# EAGLE design esp-rfid (EAGLE 9.6.2)
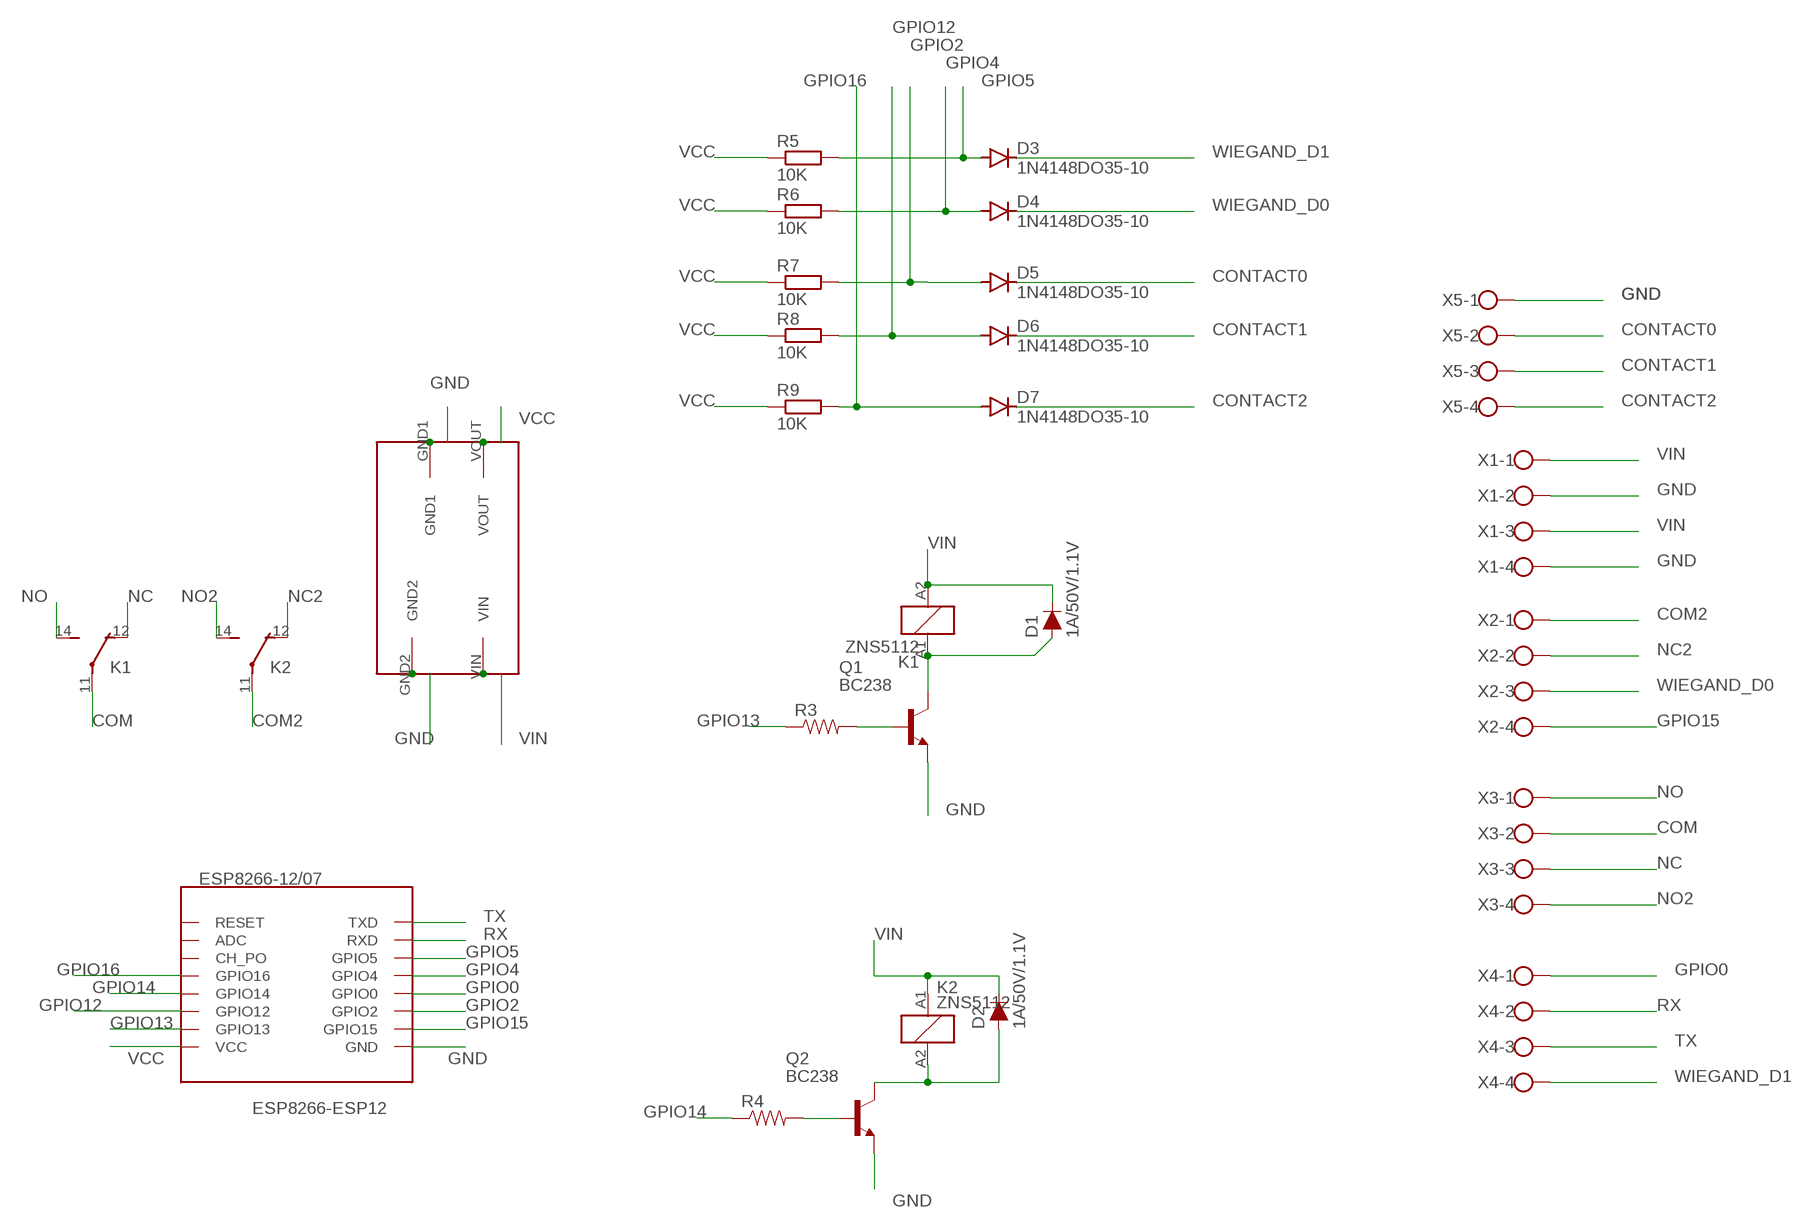
[diagram p0: schematic, sheet 1]

## Parts
D1  1A/50V/1.1V  DIODE-PTH  [DIODE-1N4001]
D2  1A/50V/1.1V  DIODE-PTH  [DIODE-1N4001]
D3  1N4148DO35-10  [DO35-10]
D4  1N4148DO35-10  [DO35-10]
D5  1N4148DO35-10  [DO35-10]
D6  1N4148DO35-10  [DO35-10]
D7  1N4148DO35-10  [DO35-10]
K1  ZNS5112  [ZN5]
K2  ZNS5112  [ZN5]
Q1  BC238  [TO92]
Q2  BC238  [TO92]
R3  RESISTORAXIAL-0.3  [AXIAL-0.3]
R4  RESISTORAXIAL-0.3  [AXIAL-0.3]
R5  10K  R-EU_0207/10  [0207/10]
R6  10K  R-EU_0207/10  [0207/10]
R7  10K  R-EU_0207/10  [0207/10]
R8  10K  R-EU_0207/10  [0207/10]
R9  10K  R-EU_0207/10  [0207/10]
U$1  ESP8266-ESP12  [ESP8266-12]
U$2  LM2596-DC-DC-STEPDOWN-BOARD  [STEPDOWN-CONVERTER]
X1  W237-4  [W237-4]
X2  W237-4  [W237-4]
X3  W237-4  [W237-4]
X4  W237-4  [W237-4]
X5  W237-4  [W237-4]

## Nets
COM: K1.11(2:P) X3.2
COM2: K2.11(2:P) X2.1
CONTACT0: D5.C X5.2
CONTACT1: D6.C X5.3
CONTACT2: D7.C X5.4
GND: Q1.1(E) Q2.1(E) U$1.GND U$2.GND1 U$2.GND2 X1.2 X1.4 X5.1
GPIO0: U$1.IO0(GPIO0) X4.1
GPIO2: D5.A R7.2 U$1.IO2(GPIO2)
GPIO4: D4.A R6.2 U$1.IO4(GPIO4)
GPIO5: D3.A R5.2 U$1.IO5(GPIO5)
GPIO12: D6.A R8.2 U$1.IO12(GPIO12)
GPIO13: R3.P$1 U$1.IO13(GPIO13)
GPIO14: R4.P$1 U$1.IO14(GPIO14)
GPIO15: U$1.IO15(GPIO15) X2.4
GPIO16: D7.A R9.2 U$1.IO16(GPIO16)
N$1: Q2.2(B) R4.P$2
N$2: D1.A K1.A1 Q1.3(C)
N$4: D2.A K2.A2 Q2.3(C)
N$15: Q1.2(B) R3.P$2
NC: K1.12(2:O) X3.3
NC2: K2.12(2:O) X2.2
NO: K1.14(2:S) X3.1
NO2: K2.14(2:S) X3.4
RX: U$1.RX(RXD) X4.2
TX: U$1.TX(TXD) X4.3
VCC [thicker]: R5.1 R6.1 R7.1 R8.1 R9.1 U$1.VCC U$2.VOUT
VIN: D1.C D2.C K1.A2 K2.A1 U$2.VIN X1.1 X1.3
WIEGAND_D0: D4.C X2.3
WIEGAND_D1: D3.C X4.4
Unconnected: U$1.ADC U$1.EN(CH_PO) U$1.RESET

## Library data of the parts
D1 D2 = SparkFun-DiscreteSemi:DIODE: Diode These are standard reverse protection diodes and small signal diodes. SparkFun Products: SparkFun SparkPunk Sound Kit <https://www.sparkfun.com/products/11177> SparkFun ESP8266 Thing <https://www.sparkfun.com/products/13231>; PROD_ID: DIO-09176
D3-D7 = diode:1N4148: DIODE high speed (Philips)
K1 K2 = relay:ZNS5*: Miniature Power PCB Relay SCHRACK 1pole 10 A Source: http://www.schrack.com/.. 5847.pdf; OC_FARNELL: unknown; OC_NEWARK: unknown
Q1 Q2 = transistor-npn:BC238: NPN Transistor
R3 R4 = SparkFun-Resistors:RESISTOR: Generic Resistor Package
R5-R9 = resistor:R-EU_: RESISTOR, European symbol
U$1 = Marc:ESP8266-ESP12: ESP-12 Breakout board 2 x 8 Pin RM 2.54 Platine für ESP 12F / 07
U$2 = Marc:LM2596-DC-DC-STEPDOWN-BOARD
X1-X5 = con-wago-500:W237-4: WAGO SCREW CLAMP; OC_FARNELL: unknown; OC_NEWARK: unknown

## Net classes
0 default: width 1.016 mm, clearance 0.505 mm
1 thicker: width 2 mm, clearance 0.505 mm to class 0, clearance 0.505 mm

## Board
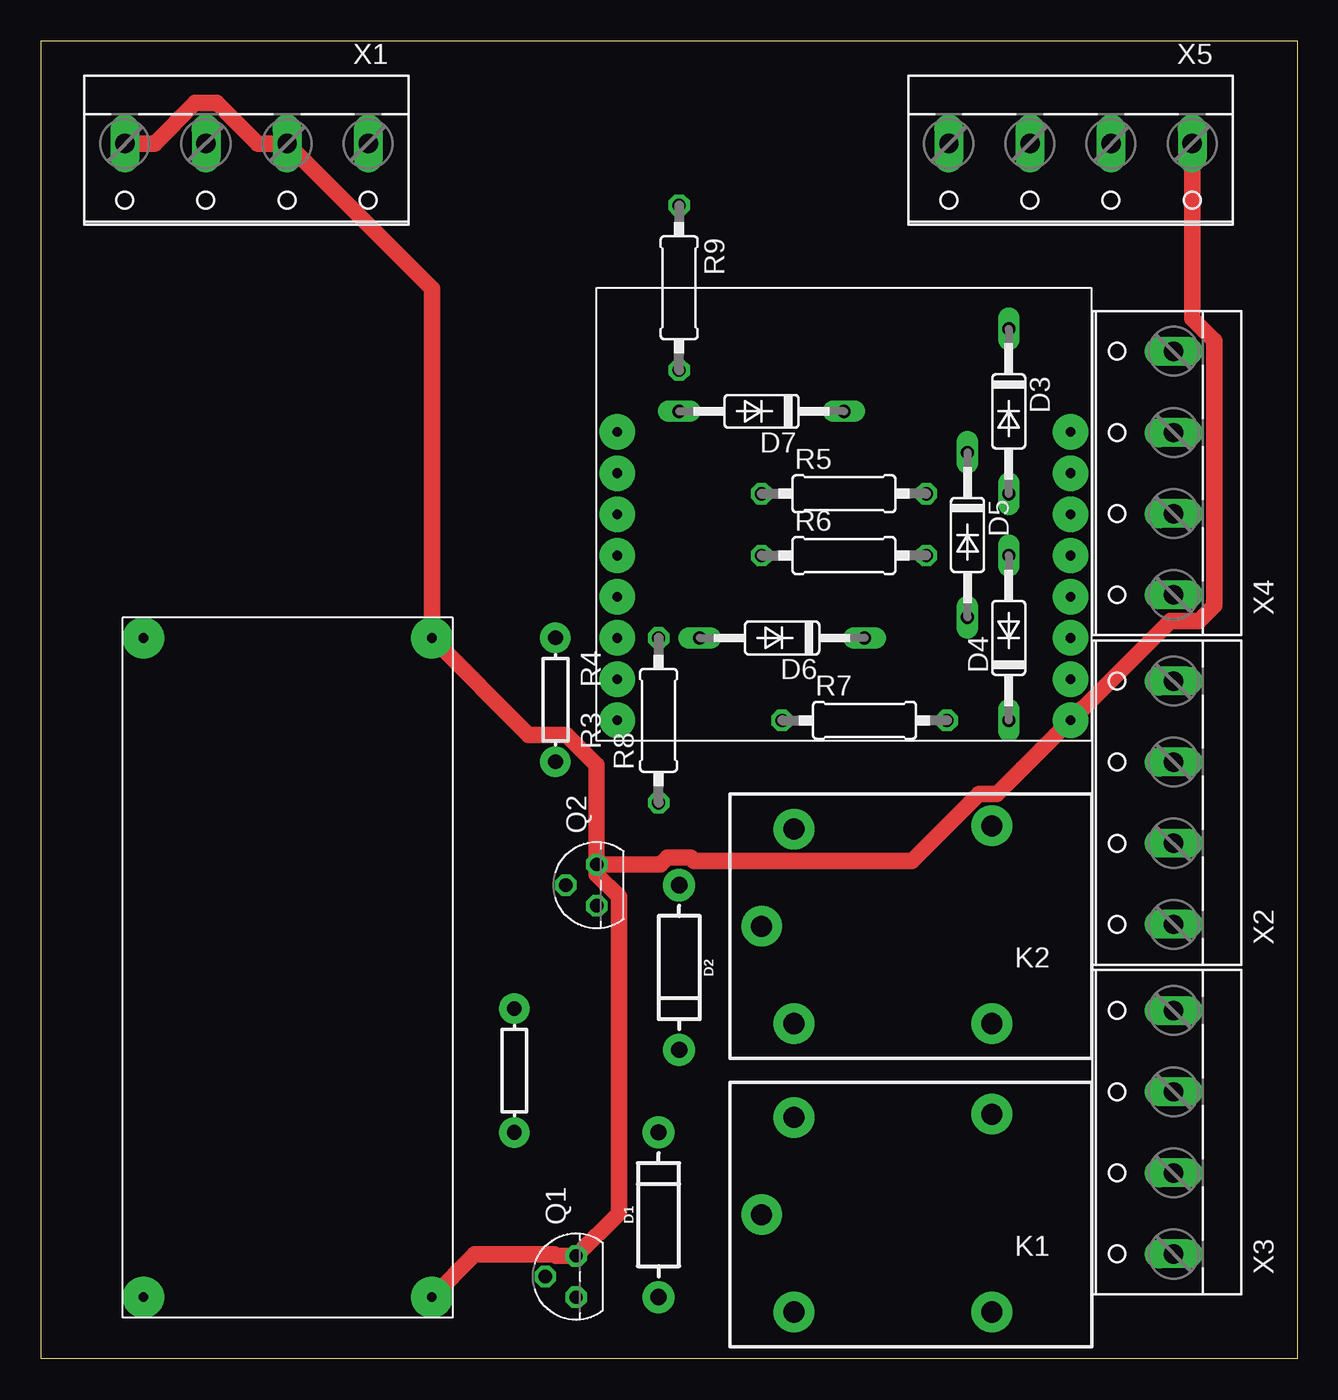
[diagram p1: board, top side]
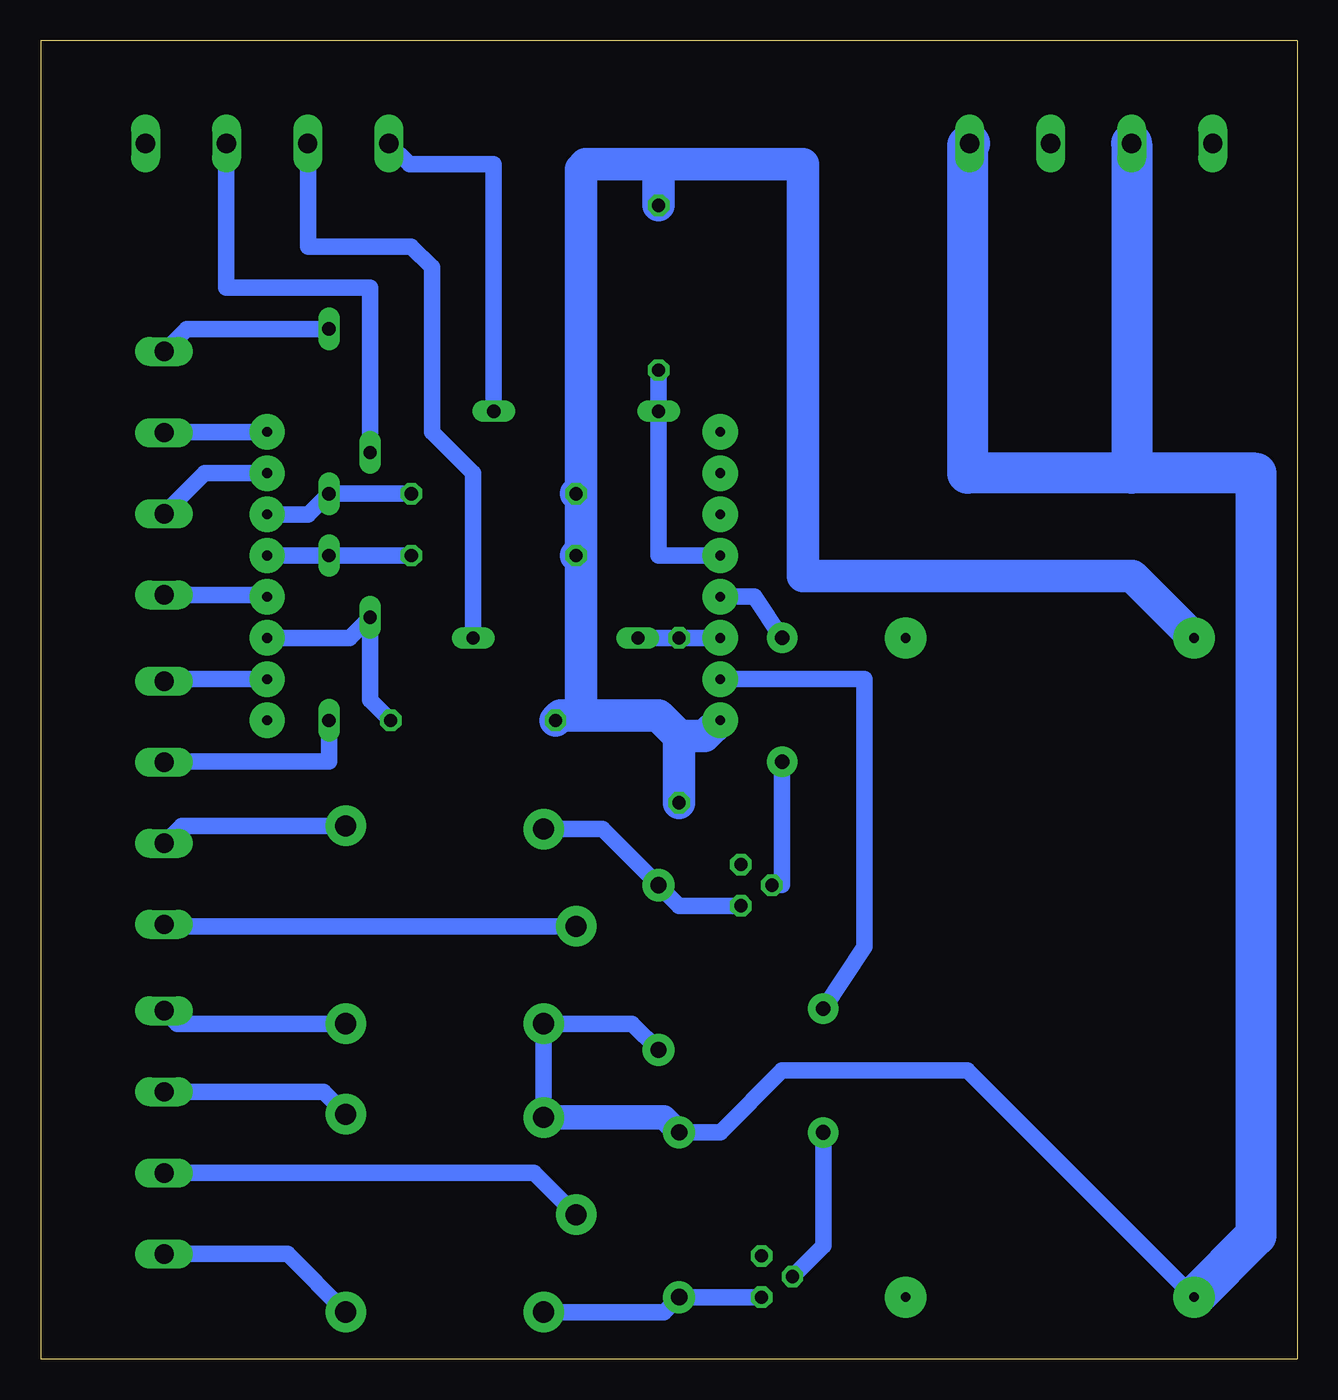
[diagram p2: board, bottom side, seen from below]

Size 77.47 x 81.28 mm. Coordinates in mm from the lower left corner, seen from the top.
Outline: 0,81.28 77.47,81.28 77.47,0 0,0 0,81.28
Copper layers (1*16): Top 0.035mm / dielectric 1.5mm / Bottom 0.035mm
Design rules "esp-rfid": minimum track width 6mil, minimum drill 0.35mm, track to track 0.305mm, track to pad 0.305mm, pad to pad 0.305mm, via to via 0.305mm, smd to smd 6mil, copper to edge 40mil, drill to drill 6mil, minimum pad ring 10mil, minimum via ring 8mil, stop-mask expansion 4mil, vias tented up to drill 0mil, thermal gap 10mil

### Footprints (pad centres in the part's own frame; a part is rotated, then mirrored left to right if it is on the bottom)
DIODE-1N4001 = drill 1 pad 1.981: A -5.08,0; C 5.08,0
DO35-10 = drill 0.813 long: A 5.08,0; C -5.08,0
ZN5 = drill 1.3 pad 2.5: 11 8.89,0; 12 -5.31,-6.2; 14 -5.31,6; A1 6.89,6; A2 6.89,-6
TO92 = drill 0.813 octagon: 1 1.27,0; 2 0,1.905; 3 -1.27,0
AXIAL-0.3 = drill 0.9 pad 1.88: P$1 -3.81,0; P$2 3.81,0
0207/10 = drill 0.813 octagon: 1 -5.08,0; 2 5.08,0
ESP8266-12 = drill 0.6 pad 2.184: ADC -3.81,6.35; EN -3.81,3.81; GND 24.13,-8.89; IO0 24.13,-1.27; IO2 24.13,-3.81; IO4 24.13,1.27; IO5 24.13,3.81; IO12 -3.81,-3.81; IO13 -3.81,-6.35; IO14 -3.81,-1.27; IO15 24.13,-6.35; IO16 -3.81,1.27; RESET -3.81,8.89; RX 24.13,6.35; TX 24.13,8.89; VCC -3.81,-8.89
STEPDOWN-CONVERTER = drill 0.6 pad 2.54: GND1 1.27,41.91; GND2 1.27,1.27; VIN 19.05,41.91; VOUT 19.05,1.27
W237-4 = drill 1.194 long: 1 -7.5,-1.27; 2 -2.5,-1.27; 3 2.5,-1.27; 4 7.5,-1.27

### Placement (x,y rotation side)
D1  38.1,8.89 90 top
D2  39.37,24.13 270 top
D3  59.69,58.42 270 top
D4  59.69,44.45 90 top
D5  57.15,50.8 270 top
D6  45.72,44.45 180 top
D7  44.45,58.42 180 top
K1  53.34,8.89 180 top
K2  53.34,26.67 180 top
Q1  33.02,5.08 90 top
Q2  34.29,29.21 90 top
R3  29.21,17.78 270 top
R4  31.75,40.64 270 top
R5  49.53,53.34 0 top
R6  49.53,49.53 0 top
R7  50.8,39.37 0 top
R8  38.1,39.37 90 top
R9  39.37,66.04 270 top
U$1  39.37,48.26 0 top
U$2  25.4,45.72 180 top
X1  12.7,73.66 180 top
X2  68.58,34.29 90 top
X3  68.58,13.97 90 top
X4  68.58,54.61 90 top
X5  63.5,73.66 180 top

### Tracks (layer width: path | path; a pad name or v marks a point on that pad's centre or on a via)
COM
  Bottom 1.016: X3.2 47.03,11.47 K1.11
COM2
  Bottom 1.016: K2.11 69.73,26.67 X2.1
CONTACT0
  Bottom 1.016: D5.C 57.15,66.04 66.04,66.04 66.04,72.39 66.04,73.62 66.04,74.89 X5.2
CONTACT1
  Bottom 1.016: D6.C 50.8,54.61 53.34,57.15 53.34,67.31 54.61,68.58 60.96,68.58 60.96,74.89 X5.3
CONTACT2
  Bottom 1.016: D7.C 49.53,73.66 54.73,73.66 X5.4
GND
  Top 1.016: Q2.1 34.29,36.63 32.44,38.48 30.1,38.48 U$2.GND2 24.13,66 X1.2 13.37,74.93 10.87,77.43 9.53,77.43 7.03,74.93 X1.4 | X5.1 71,64.13 72.35,62.78 72.35,46.44 71.41,45.5 69.64,45.5 64.25,40.1 64.23,40.1 U$1.GND 58.96,34.83 57.84,34.83 53.71,30.71 40.28,30.71 40.08,30.91 38.66,30.91 38.23,30.48 Q2.1 | Q2.1 34.29,29.88 35.66,28.51 35.66,8.99 Q1.1 31.79,6.35 31.68,6.45 26.77,6.45 U$2.GND1
GPIO0
  Bottom 1.016: U$1.IO0 63.62,47.11 X4.1
GPIO2
  Bottom 1.016: U$1.IO2 58.42,44.45 D5.A 57.15,40.64 R7.2
GPIO4
  Bottom 1.016: U$1.IO4 D4.A R6.2
GPIO5
  Bottom 1.016: R5.2 D3.A 60.96,52.07 U$1.IO5
GPIO12
  Bottom 1.016: U$1.IO12 R8.2 D6.A
GPIO13
  Bottom 1.016: U$1.IO13 26.67,41.91 26.67,25.4 R3.P$1
GPIO14
  Bottom 1.016: R4.P$1 33.44,46.99 U$1.IO14
GPIO15
  Bottom 1.016: U$1.IO15 69.73,41.91 X2.4
GPIO16
  Bottom 1.016: R9.2 D7.A 39.37,49.53 U$1.IO16
N$1
  Bottom 1.016: Q2.2 31.75,29.21 R4.P$2
N$2
  Bottom 1.016: K1.A1 39.02,2.89 D1.A Q1.3
N$4
  Bottom 1.016: K2.A2 42.83,32.67 D2.A 38.1,27.94 Q2.3
N$15
  Bottom 1.016: R3.P$2 29.21,6.99 Q1.2
NC
  Bottom 1.016: X3.3 60.03,16.47 K1.12
NC2
  Bottom 1.016: K2.12 68.77,32.87 X2.2
NO
  Bottom 1.016: X3.1 62.23,6.47 K1.14
NO2
  Bottom 1.016: K2.14 69.05,20.67 X3.4
RX
  Bottom 1.016: U$1.RX 67.35,54.61 X4.2
TX
  Bottom 1.016: U$1.TX 69.81,57.15 X4.3
VCC
  Bottom 2: 38.1,38.4 36.54,38.4 U$1.VCC | 44.16,39.66 39.37,39.66 38.1,38.4 | U$2.VOUT 10.16,48.26 30.48,48.26 30.48,73.66 39.37,73.66 | 44.16,39.66 44.16,49.83 | 44.16,49.83 44.16,53.34 | 44.16,53.34 44.16,73.36 43.86,73.66 39.37,73.66 | R7.1 45.43,39.66 44.16,39.66 | R6.1 44.16,49.83 | 44.16,53.34 R5.1 | 38.1,38.4 R8.1 | 39.37,73.66 R9.1
VIN
  Bottom 1.016: U$2.VIN 20.32,17.78 31.75,17.78 35.56,13.97 D1.C | D2.C 40.99,20.67 K2.A1 K1.A2
  Bottom 1.5: K1.A2 39.02,14.89 D1.C
  Bottom 2.54: X1.1 20.32,74.81 20.32,54.61 10.2,54.61 | U$2.VIN 2.54,7.62 2.54,54.61 10.2,54.61 | X1.3 10.2,54.61
WIEGAND_D0
  Bottom 1.016: X2.3 69.81,36.83 59.69,36.83 D4.C
WIEGAND_D1
  Bottom 1.016: X4.4 68.46,63.5 D3.C